# EAGLE design Arduino-UNO-SMD-Rev3e (EAGLE 6.4)
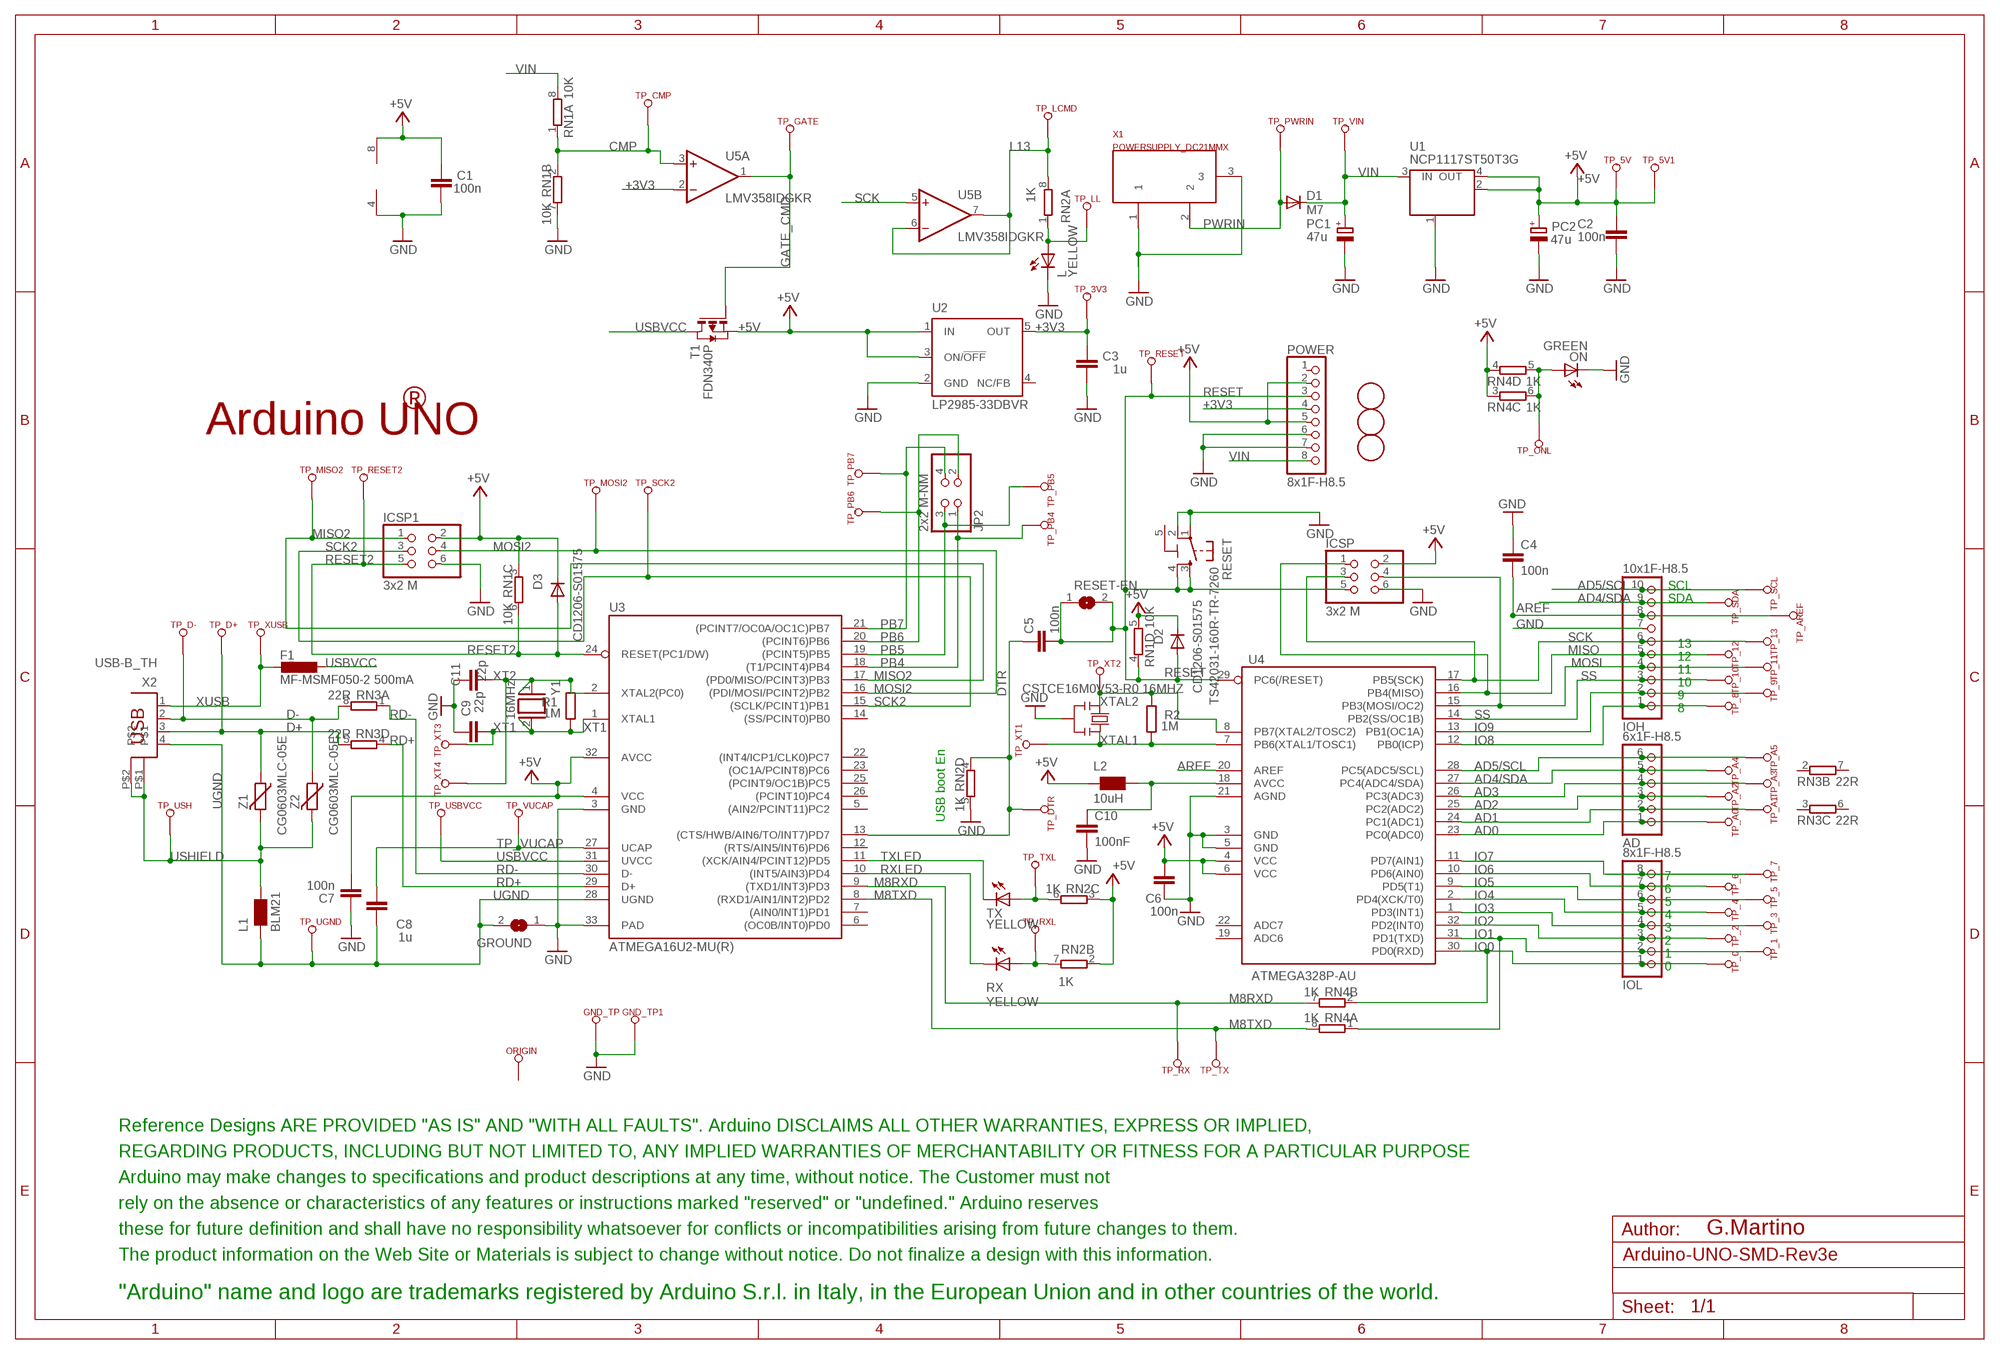
[diagram p0: schematic, sheet 1]

## Parts
AD  6x1F-H8.5  PINHD-1X6  [1X06]
C1  100n  C-EU0603-RND  [C0603-ROUND]
C2  100n  C-EU0603-RND  [C0603-ROUND]
C3  1u  C-EU0603-RND  [C0603-ROUND]
C4  100n  C-EU0603-RND  [C0603-ROUND]
C5  100n  C-EU0603-RND  [C0603-ROUND]
C6  100n  C-EU0603-RND  [C0603-ROUND]
C7  100n  C-EU0603-RND  [C0603-ROUND]
C8  1u  C-EU0603-RND  [C0603-ROUND]
C9  22p  C-EU0603-RND  [C0603-ROUND]
C10  100nF  0015_100NF_0603  [C0603-ROUND]
C11  22p  C-EU0603-RND  [C0603-ROUND]
D1  M7  DIODE-SMB  [SMB]
D2  CD1206-S01575  DIODE-MINIMELF  [MINIMELF]
D3  CD1206-S01575  DIODE-MINIMELF  [MINIMELF]
F1  MF-MSMF050-2 500mA  L-EUL1812  [L1812]
FD1  FIDUCIALMOUNT  [FIDUCIA-MOUNT]
FD2  FIDUCIALMOUNT  [FIDUCIA-MOUNT]
FD3  FIDUCIALMOUNT  [FIDUCIA-MOUNT]
GND_TP  TP_SP  [TP-SP]
GND_TP1  TP_SP  [TP-SP]
GROUND  SJ  [SJ]
ICSP  3x2 M  PINHD-2X3  [2X03]
ICSP1  3x2 M  PINHD-2X3  [2X03]
IOH  10x1F-H8.5  PINHD-1X10_ARD  [1X10]
IOL  8x1F-H8.5  PINHD-1X8  [1X08]
JP2  2x2 M-NM  PINHD-2X2  [2X02]
L  YELLOW  LEDCHIP-LED0805  [CHIP-LED0805]
L1  BLM21  WE-CBF_0805  [0805]
L2  10uH  0715_CV201210-100K  [0805]
ON  GREEN  LEDCHIP-LED0805  [CHIP-LED0805]
ORIGIN  TP_SP  [TP-SP]
PC1  47u  CPOL-EUD  [PANASONIC_D]
PC2  47u  CPOL-EUD  [PANASONIC_D]
POWER  8x1F-H8.5  PINHD-1X8  [1X08]
R1  1M  R-EU_R0603  [R0603-ROUND]
R2  1M  R-EU_R0603  [R0603-ROUND]
RESET  TS42031-160R-TR-7260  TS42  [TS42]
RESET-EN  SJ  [SJ]
RN1  10K  4R-NCAY16  [CAY16]
RN2  1K  4R-NCAY16  [CAY16]
RN3  22R  4R-NCAY16  [CAY16]
RN4  1K  4R-NCAY16  [CAY16]
RX  YELLOW  LEDCHIP-LED0805  [CHIP-LED0805]
T1  FDN340P  PMOSSOT23  [SOT-23]
TP_0  TP_SP  [TP-SP]
TP_1  TP_SP  [TP-SP]
TP_2  TP_SP  [TP-SP]
TP_3  TP_SP  [TP-SP]
TP_3V3  TP_SP  [TP-SP]
TP_4  TP_SP  [TP-SP]
TP_5  TP_SP  [TP-SP]
TP_5V  TP_SP  [TP-SP]
TP_5V1  TP_SP  [TP-SP]
TP_6  TP_SP  [TP-SP]
TP_7  TP_SP  [TP-SP]
TP_8  TP_SP  [TP-SP]
TP_9  TP_SP  [TP-SP]
TP_10  TP_SP  [TP-SP]
TP_11  TP_SP  [TP-SP]
TP_12  TP_SP  [TP-SP]
TP_13  TP_SP  [TP-SP]
TP_A0  TP_SP  [TP-SP]
TP_A1  TP_SP  [TP-SP]
TP_A2  TP_SP  [TP-SP]
TP_A3  TP_SP  [TP-SP]
TP_A4  TP_SP  [TP-SP]
TP_A5  TP_SP  [TP-SP]
TP_AREF  TP_SP  [TP-SP]
TP_CMP  TP_SP  [TP-SP]
TP_D+  TP_SP  [TP-SP]
TP_D-  TP_SP  [TP-SP]
TP_DTR  TP_SP  [TP-SP]
TP_GATE  TP_SP  [TP-SP]
TP_LCMD  TP_SP  [TP-SP]
TP_LL  TP_SP  [TP-SP]
TP_MISO2  TP_SP  [TP-SP]
TP_MOSI2  TP_SP  [TP-SP]
TP_ONL  TP_SP  [TP-SP]
TP_PB4  TP_SP  [TP-SP]
TP_PB5  TP_SP  [TP-SP]
TP_PB6  TP_SP  [TP-SP]
TP_PB7  TP_SP  [TP-SP]
TP_PWRIN  TP_SP  [TP-SP]
TP_RESET  TP_SP  [TP-SP]
TP_RESET2  TP_SP  [TP-SP]
TP_RX  TP_SP  [TP-SP]
TP_RXL  TP_SP  [TP-SP]
TP_SCK2  TP_SP  [TP-SP]
TP_SCL  TP_SP  [TP-SP]
TP_SDA  TP_SP  [TP-SP]
TP_TX  TP_SP  [TP-SP]
TP_TXL  TP_SP  [TP-SP]
TP_UGND  TP_SP  [TP-SP]
TP_USBVCC  TP_SP  [TP-SP]
TP_USH  TP_SP  [TP-SP]
TP_VIN  TP_SP  [TP-SP]
TP_VUCAP  TP_SP  [TP-SP]
TP_XT1  TP_SP  [TP-SP]
TP_XT2  TP_SP  [TP-SP]
TP_XT3  TP_SP  [TP-SP]
TP_XT4  TP_SP  [TP-SP]
TP_XUSB  TP_SP  [TP-SP]
TX  YELLOW  LEDCHIP-LED0805  [CHIP-LED0805]
U1  NCP1117ST50T3G  MC33269ST-3.3T3  [SOT223]
U2  LP2985-33DBVR  LP2985-XXDBVR33  [SOT23-DBV]
U3  ATMEGA16U2-MU(R)  ATMEGA16U2-MU  [MLF32]
U4  ATMEGA328P-AU  ATMEGAXX8-MUR  [MLF32]
U5  LMV358IDGKR  LMV358MMX  [MSOP08]
U$2  DISCLAIMER-SMALL  [DISCLAIMER]
X1  POWERSUPPLY_DC21MMX  [POWERSUPPLY_DC-21MM]
X2  USB-B_TH  PN61729  [PN61729]
Y1  16MHz  XTAL/S  [QS]
Y2  CSTCE16M0V53-R0 16MHZ  RESONATORMU  [RESONATOR]
Z1  CG0603MLC-05E  VARISTORCN0603  [CT/CN0603]
Z2  CG0603MLC-05E  VARISTORCN0603  [CT/CN0603]

## Nets
+3V3: C3.2 POWER.4 TP_3V3.X(TESTP) U2.5(OUT) U5.2(A:-IN)
+5V [usbvcc]: C1.2 C2.2 C6.2 C7.1 D2.C D3.C ICSP1.2 ICSP.2 L2.1 PC2.+ POWER.2 POWER.5 RN1.3 RN1.5 RN2.2 RN2.3 RN4.3 RN4.4 T1.2(S) TP_5V1.X(TESTP) TP_5V.X(TESTP) U1.2(OUT) U1.4(OUT) U2.1(IN) U2.3(ON/!OFF) U3.4(VCC) U3.32(AVCC) U4.4(VCC) U4.6(VCC) U5.8(P:V+)
AD0: AD.1 TP_A0.X(TESTP) U4.23(PC0(ADC0))
AD1: AD.2 TP_A1.X(TESTP) U4.24(PC1(ADC1))
AD2: AD.3 TP_A2.X(TESTP) U4.25(PC2(ADC2))
AD3: AD.4 TP_A3.X(TESTP) U4.26(PC3(ADC3))
AD4/SDA: AD.5 IOH.9 TP_A4.X(TESTP) TP_SDA.X(TESTP) U4.27(PC4(ADC4/SDA))
AD5/SCL: AD.6 IOH.10 TP_A5.X(TESTP) TP_SCL.X(TESTP) U4.28(PC5(ADC5/SCL))
AREF [aref]: C4.2 IOH.8 TP_AREF.X(TESTP) U4.20(AREF)
CMP: RN1.1 RN1.2 TP_CMP.X(TESTP) U5.3(A:+IN)
D+: RN3.5 TP_D+.X(TESTP) X2.3 Z1.1
D-: RN3.8 TP_D-.X(TESTP) X2.2 Z2.1
DTR: C5.1 RN2.4 TP_DTR.X(TESTP) U3.13((CTS/HWB/AIN6/TO/INT7)PD7)
GATE_CMD: T1.3(G) TP_GATE.X(TESTP) U5.1(A:OUT)
GND [gnd]: C1.1 C2.1 C3.1 C4.1 C6.1 C7.2 C9.2 C10.2 C11.2 GND_TP1.X(TESTP) GND_TP.X(TESTP) GROUND.1 ICSP1.6 ICSP.6 IOH.7 L.C ON.C PC1.- PC2.- POWER.6 POWER.7 RESET.1 RESET.2 RN1.7 RN2.5 U1.1(GND/ADJ) U2.2(GND) U3.3(GND) U3.33(PAD) U4.3(GND) U4.5(GND) U4.21(AGND) U5.4(P:V-) X1.1 X1.3 Y2.2
IO0: IOL.1 RN4.2 TP_0.X(TESTP) U4.30(PD0(RXD))
IO1: IOL.2 RN4.1 TP_1.X(TESTP) U4.31(PD1(TXD))
IO2: IOL.3 TP_2.X(TESTP) U4.32(PD2(INT0))
IO3: IOL.4 TP_3.X(TESTP) U4.1(PD3(INT1))
IO4: IOL.5 TP_4.X(TESTP) U4.2(PD4(XCK/T0))
IO5: IOL.6 TP_5.X(TESTP) U4.9(PD5(T1))
IO6: IOL.7 TP_6.X(TESTP) U4.10(PD6(AIN0))
IO7: IOL.8 TP_7.X(TESTP) U4.11(PD7(AIN1))
IO8: IOH.1 TP_8.X(TESTP) U4.12(PB0(ICP))
IO9: IOH.2 TP_9.X(TESTP) U4.13(PB1(OC1A))
L13: RN2.8 TP_LCMD.X(TESTP) U5.6(B:-IN) U5.7(B:OUT)
M8RXD: RN4.7 TP_RX.X(TESTP) U3.9((TXD1/INT3)PD3)
M8TXD: RN4.8 TP_TX.X(TESTP) U3.8((RXD1/AIN1/INT2)PD2)
MISO: ICSP.1 IOH.5 TP_12.X(TESTP) U4.16(PB4(MISO))
MISO2: ICSP1.1 TP_MISO2.X(TESTP) U3.17((PD0/MISO/PCINT3)PB3)
MOSI: ICSP.4 IOH.4 TP_11.X(TESTP) U4.15(PB3(MOSI/OC2))
MOSI2: ICSP1.4 TP_MOSI2.X(TESTP) U3.16((PDI/MOSI/PCINT2)PB2)
N$1: L.A RN2.1 TP_LL.X(TESTP)
N$3: ON.A RN4.5 RN4.6 TP_ONL.X(TESTP)
N$4 [usbvcc]: C10.1 L2.2 U4.18(AVCC)
N$35: RN2.7 RX.A TP_RXL.X(TESTP)
N$36: RN2.6 TP_TXL.X(TESTP) TX.A
PB4: JP2.1 TP_PB4.X(TESTP) U3.18((T1/PCINT4)PB4)
PB5: JP2.3 TP_PB5.X(TESTP) U3.19((PCINT5)PB5)
PB6: JP2.2 TP_PB6.X(TESTP) U3.20((PCINT6)PB6)
PB7: JP2.4 TP_PB7.X(TESTP) U3.21((PCINT7/OC0A/OC1C)PB7)
PWRIN [power]: D1.A TP_PWRIN.X(TESTP) X1.2
RD+: RN3.4 U3.29(D+)
RD-: RN3.1 U3.30(D-)
RESET: C5.2 D2.A ICSP.5 POWER.3 RESET-EN.1 RESET-EN.2 RESET.3 RESET.4 RN1.4 TP_RESET.X(TESTP) U4.29(PC6(/RESET))
RESET2: D3.A ICSP1.5 RN1.6 TP_RESET2.X(TESTP) U3.24(RESET(PC1/DW))
RXLED: RX.C U3.10((INT5/AIN3)PD4)
SCK: ICSP.3 IOH.6 TP_13.X(TESTP) U4.17(PB5(SCK)) U5.5(B:+IN)
SCK2: ICSP1.3 TP_SCK2.X(TESTP) U3.15((SCLK/PCINT1)PB1)
SS: IOH.3 TP_10.X(TESTP) U4.14(PB2(SS/OC1B))
TP_VUCAP: C8.1 TP_VUCAP.X(TESTP) U3.27(UCAP)
TXLED: TX.C U3.11((XCK/AIN4/PCINT12)PD5)
UGND [gnd]: C8.2 GROUND.2 L1.1 TP_UGND.X(TESTP) U3.28(UGND) X2.4
USBVCC [usbvcc]: F1.1 T1.1(D) TP_USBVCC.X(TESTP) U3.31(UVCC)
USHIELD [gnd]: L1.2 TP_USH.X(TESTP) X2.P$1 X2.P$2 Z1.2 Z2.2
VIN [power]: D1.C PC1.+ POWER.8 RN1.8 TP_VIN.X(TESTP) U1.3(IN)
XT1: C9.1 R1.1 TP_XT3.X(TESTP) U3.1(XTAL1) Y1.2
XT2: C11.1 R1.2 TP_XT4.X(TESTP) U3.2(XTAL2(PC0)) Y1.1
XTAL1: R2.1 TP_XT1.X(TESTP) U4.7(PB6(XTAL1/TOSC1)) Y2.3
XTAL2: R2.2 TP_XT2.X(TESTP) U4.8(PB7(XTAL2/TOSC2)) Y2.1
XUSB [usbvcc]: F1.2 TP_XUSB.X(TESTP) X2.1
Unconnected: ORIGIN.X(TESTP) POWER.1 RN3.2 RN3.3 RN3.6 RN3.7 U2.4(NC/FB) U3.5((AIN2/PCINT11)PC2) U3.6((OC0B/INT0)PD0) U3.7((AIN0/INT1)PD1) U3.12((RTS/AIN5/INT6)PD6) U3.14((SS/PCINT0)PB0) U3.22((INT4/ICP1/CLK0)PC7) U3.23((OC1A/PCINT8)PC6) U3.25((PCINT9/OC1B)PC5) U3.26((PCINT10)PC4) U4.19(ADC6) U4.22(ADC7)

## Notes on the sheet
- ®
- Arduino UNO
- SCL
- SDA
- 13
- 12
- 11
- 10
- 9
- 8
- USB boot En
- 7
- 6
- 5
- 4
- 3
- 2
- 1
- 0
- G.Martino

## Power pins joined to a net without a drawn wire
5-GND: RESET.5(5-GND)

## Library data of the parts
AD = SmartPrj:PINHD-1X6: PIN HEADER
C1-C9 C11 = SmartPrj:C-EU: CAPACITOR, European symbol
C10 = Condensatori:0015_100NF_0603: 100nF 0603; CASE: 0603; MONTHLY_USAGE: _____; PART_NUMBER: 100nF_0603; PRICE: _____; SUPPLIER: _____; TYPE: Condensatori
D1-D3 = diode:DIODE-: DIODE
F1 = rcl:L-EU: INDUCTOR, European symbol
FD1-FD3 = SmartPrj:FIDUCIALMOUNT
GND_TP GND_TP1 ORIGIN TP_0 TP_1-TP_3 TP_3V3 TP_4 TP_5 TP_5V TP_5V1 TP_6-TP_13 TP_A0 TP_A1-TP_A5 TP_AREF TP_CMP TP_D+ TP_D- TP_DTR TP_GATE TP_LCMD TP_LL TP_MISO2 TP_MOSI2 TP_ONL TP_PB4-TP_PB7 TP_PWRIN TP_RESET TP_RESET2 TP_RX TP_RXL TP_SCK2 TP_SCL TP_SDA TP_TX TP_TXL TP_UGND TP_USBVCC TP_USH TP_VIN TP_VUCAP TP_XT1-TP_XT4 TP_XUSB = SmartPrj:TP_SP
GROUND RESET-EN = jumper:SJ: SMD solder JUMPER
ICSP ICSP1 = SmartPrj:PINHD-2X3: PIN HEADER
IOH = SmartPrj:PINHD-1X10_ARD: PIN HEADER
IOL POWER = SmartPrj:PINHD-1X8: PIN HEADER
JP2 = SmartPrj:PINHD-2X2: PIN HEADER
L ON RX TX = led:LED: LED OSRAM: - CHIPLED LG R971, LG N971, LY N971, LG Q971, LY Q971, LO R971, LY R971 LH N974, LH R974 LS Q976, LO Q976, LY Q976 LO Q996 - Hyper CHIPLED LW Q18S LB Q993, LB Q99A, LB R99A - SideLED LS A670, LO A670, LY A670, LG A670, LP A670 LB A673, LV A673, LT A673, LW A673 LH A674 LY A675 LS A676, LA A676, LO A676, LY A676, LW A676 LS A679, LY A679, LG A679 - Hyper Micro SIDELED® LS Y876, LA Y876, LO Y876, LY Y876 LT Y87S - SmartLED LW L88C, LW L88S LB L89C, LB L89S, LG L890 LS L89K, LO L89K, LY L89K LS L896, LA L896, LO L896, LY L896 - TOPLED LS T670, LO T670, LY T670, LG T670, LP T670 LSG T670, LSP T670, LSY T670, LOP T670, LYG T670 LG T671, LOG T671, LSG T671 LB T673, LV T673, LT T673, LW T673 LH T674 LS T676, LA T676, LO T676, LY T676, LB T676, LH T676, LSB T676, LW T676 LB T67C, LV T67C, LT T67C, LS T67K, LO T67K, LY T67K, LW E67C LS E67B, LA E67B, LO E67B, LY E67B, LB E67C, LV E67C, LT E67C LW T67C LS T679, LY T679, LG T679 LS T770, LO T770, LY T770, LG T770, LP T770 LB T773, LV T773, LT T773, LW T773 LH T774 LS E675, LA E675, LY E675, LS T675 LS T776, LA T776, LO T776, LY T776, LB T776 LHGB T686 LT T68C, LB T68C - Hyper Mini TOPLED® LB M676 - Mini TOPLED Santana® LG M470 LS M47K, LO M47K, LY M47K Source: http://www.osram.convergy.de LUXEON: - LUMILED® LXK2-PW12-R00, LXK2-PW12-S00, LXK2-PW14-U00, LXK2-PW14-V00 LXK2-PM12-R00, LXK2-PM12-S00, LXK2-PM14-U00 LXK2-PE12-Q00, LXK2-PE12-R00, LXK2-PE12-S00, LXK2-PE14-T00, LXK2-PE14-U00 LXK2-PB12-K00, LXK2-PB12-L00, LXK2-PB12-M00, LXK2-PB14-N00, LXK2-PB14-P00, LXK2-PB14-Q00 LXK2-PR12-L00, LXK2-PR12-M00, LXK2-PR14-Q00, LXK2-PR14-R00 LXK2-PD12-Q00, LXK2-PD12-R00, LXK2-PD12-S00 LXK2-PH12-R00, LXK2-PH12-S00 LXK2-PL12-P00, LXK2-PL12-Q00, LXK2-PL12-R00 Source: www.luxeon.com KINGBRIGHT: KA-3528ASYC Source: www.kingbright.com
L1 = wuerth-elektronik:WE-CBF: SMD EMI Suppression Ferrite Beads - excellent anti-EMI properties - low DCR - impedances till 3000 ohms - rated current up to 6 A
L2 = Induttanze:0715_CV201210-100K: 10uH 0805; CASE: 0805; MONTHLY_USAGE: _____; PART_NUMBER: CV201210-100K; PRICE: _____; SUPPLIER: _____; TYPE: Induttanze
PC1 PC2 = rcl:CPOL-EU: POLARIZED CAPACITOR, European symbol
R1 R2 = SmartPrj:R-EU_: RESISTOR, European symbol
RESET = SmartPrj:TS42: TS42 Dongnan Electronics Tact switch VDC 12V - 50mA
RN1-RN4 = resistor-dil:4R-N: Array Chip Resistor Source: RS Component / Phycomp
T1 = zetex:PMOSSOT23: MOS FET
U1 = linear:MC33269ST*: Adjustable Output Low Dropout Voltage Regulator 800 mA Source: http://www.onsemi.com/pub/Collateral/MC33269-D.PDF
U2 = SmartPrj:LP2985-XXDBVR: ULTRALOW-POWER 50-mA LOW-DROPOUT LINEAR REGULATORS 50-mA Low-Dropout Regulator Source: http://focus.ti.com/lit/ds/symlink/tps77001.pdf
U3 = SmartPrj:ATMEGA16U2-
U4 = SmartPrj:ATMEGAXX8: MICROCONTROLLER 8 Kbytes FLASH 1 kbytes SRAM 512 bytes EEPROM USART 6-channel 10 bit ADC 2-channel 8 bit ADC Source: avr.lbr
U5 = linear:LMV358?*: Dual General Purpose, Low Voltage, Rail-to-Rail Output Operational Amplifiers Source: http://www.national.com/mpf/LM/LMV321.html http://www.national.com/dt/lmv_qual.pdf
U$2 = Misc:DISCLAIMER-SMALL: DISCLAIMER
X1 = SmartPrj:POWERSUPPLY_DC21MM
X2 = SmartPrj:PN61729: BERG USB connector
Y1 = SmartPrj:XTAL/S: CRYSTAL
Y2 = SmartPrj:RESONATOR
Z1 Z2 = varistor:VARISTOR: VARISTOR

## Net classes
0 default: width 0.254 mm, clearance 0.254 mm
1 power: width 0.61 mm, drill 0.61 mm, clearance 0.254 mm
2 gnd: width 0.305 mm, drill 0.559 mm, clearance 0.254 mm
3 usbvcc: width 0.508 mm, drill 0.61 mm, clearance 0.254 mm
4 aref: width 0.406 mm, drill 0.61 mm, clearance 0.254 mm

## Board
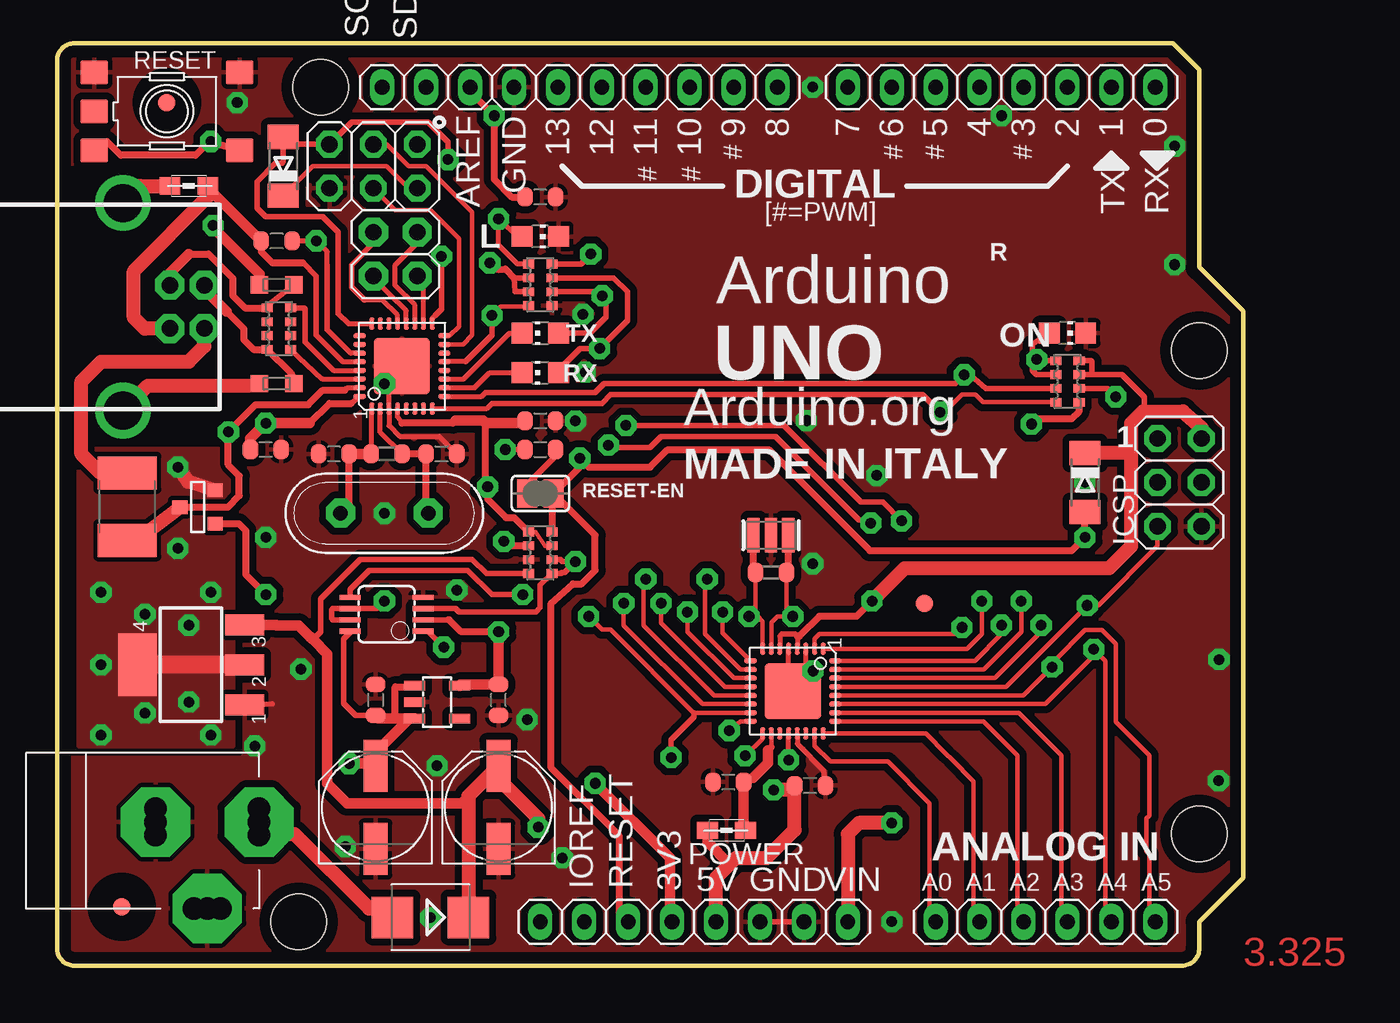
[diagram p1: board, top side]
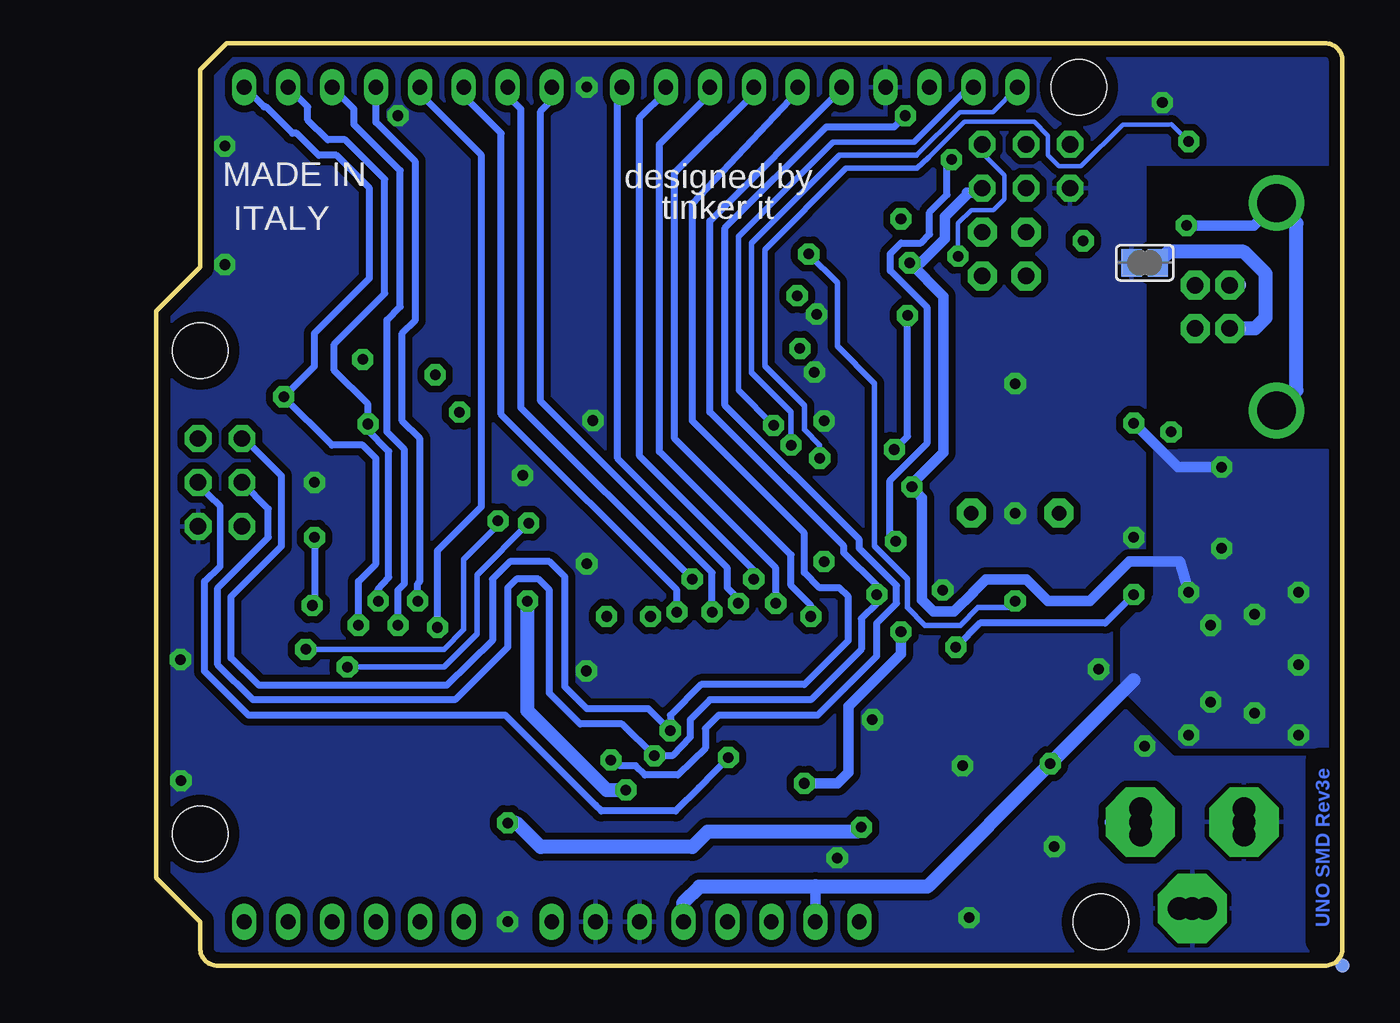
[diagram p2: board, bottom side, seen from below]

Size 68.58 x 53.34 mm. Coordinates in mm from the lower left corner, seen from the top.
Outline: 0,1 arc90 1,0 65.04,0 arc90 66.04,1 66.04,2.54 68.58,5.08 68.58,37.85 66.04,40.39 66.04,51.82 64.52,53.34 1,53.34 arc90 0,52.34
Outline: 0,52.32 0,1.02
Copper layers (1*16): Top 0.035mm / dielectric 1.5mm / Bottom 0.035mm
Design rules "ArduinoUno *": minimum track width 10mil, minimum drill 22mil, track to track 10mil, track to pad 10mil, pad to pad 10mil, via to via 12mil, smd to smd 8mil, copper to edge 26mil, drill to drill 12mil, minimum pad ring 10mil, minimum via ring 12mil, stop-mask expansion 1mil, vias tented up to drill 30mil, thermal gap 10mil
Holes 3.2 mm at 66.04,35.56 66.04,7.62 15.24,50.8 13.97,2.54
bKeepout: area -0.1,3.2 to 1.9,11
bRestrict: 5 lines
vRestrict: area 22.9,44.1 to 24.6,49.1; area 25.4,45.5 to 27.1,49.1; area 28.4,45.3 to 29.6,48.8; area 31,45.3 to 32.1,48.8; area 33.5,45.3 to 34.7,48.8; area 36.1,45.3 to 37.2,48.8; area 38.7,47.2 to 39.9,48.8; area 40.3,45.1 to 47.6,46.9; area 60.3,44.2 to 61.7,46.7; area 62.9,44.2 to 64.3,46.7; area 61.3,35.8 to 64.8,37.2; area 0.6,21.8 to 2,30.1; area 5.7,22.6 to 7.4,30.1; area 47.9,10.3 to 48.5,10.8; area 50.4,10.2 to 50.9,11; area 11.3,28.8 to 12.7,31.1; area 44.8,47.5 to 46.1,48.9; area 47.6,47.4 to 48.8,48.9; area 50.2,47.4 to 51.3,48.9; area 52.8,47.4 to 54,48.9; area 55.2,47.4 to 56.4,48.9; area 57.9,47.4 to 59.1,48.9; area 60.5,47.4 to 61.6,48.9; area 63,47.4 to 64.1,48.9; area 41.3,47.2 to 42.4,48.8; area 0.3,12.4 to 9.4,24.5

### Footprints (pad centres in the part's own frame; a part is rotated, then mirrored left to right if it is on the bottom)
1X06 = drill 0.85 pad 1.422 long: 1 -6.35,0; 2 -3.81,0; 3 -1.27,0; 4 1.27,0; 5 3.81,0; 6 6.35,0
C0603-ROUND = smd 0.898 x 1.1: 1 -0.889,0; 2 0.889,0
SMB = smd 2.4 x 2.4: A 2.2,0; C -2.2,0
MINIMELF = smd 1.4 x 1.8: A 1.7,0; C -1.7,0
L1812 = smd 1.9 x 3.4: 1 -1.95,0; 2 1.95,0
FIDUCIA-MOUNT = smd 1.016 x 1.016: P$1 0,0
TP-SP = smd 0.8 x 0.8 bottom: X 0,0
SJ = smd 1.168 x 1.6: 1 -0.762,0; 2 0.762,0
2X03 = drill 0.95 pad 1.55 octagon: 1 -2.54,-1.27; 2 -2.54,1.27; 3 0,-1.27; 4 0,1.27; 5 2.54,-1.27; 6 2.54,1.27
1X10@1 = drill 0.85 pad 1.422 long: 1 -11.43,0; 2 -8.89,0; 3 -6.35,0; 4 -3.81,0; 5 -1.27,0; 6 1.27,0; 7 3.81,0; 8 6.35,0; 9 8.89,0; 10 11.43,0
1X08 = drill 0.85 pad 1.422 long: 1 -8.89,0; 2 -6.35,0; 3 -3.81,0; 4 -1.27,0; 5 1.27,0; 6 3.81,0; 7 6.35,0; 8 8.89,0
2X02 = drill 0.95 pad 1.676 octagon: 1 -1.27,-1.27; 2 -1.27,1.27; 3 1.27,-1.27; 4 1.27,1.27
CHIP-LED0805 = smd 1.2 x 1.2: A 0,-1.05; C 0,1.05
0805 = smd 1.2 x 1: 1 -1.1,0; 2 1.1,0
PANASONIC_D = smd 3 x 1.4: + 2.4,0; - -2.4,0
R0603-ROUND = smd 0.898 x 1.1: 1 -0.889,0; 2 0.889,0
TS42 = smd 1.6 x 1.4: 1 -4.2,2.25; 2 4.2,2.25; 3 -4.2,-2.25; 4 4.2,-2.25; 5 -4.2,0
CAY16 = smd 0.5 x 0.65: 1 -1.2,-0.675; 2 -0.4,-0.675; 3 0.4,-0.675; 4 1.2,-0.675; 5 1.2,0.675; 6 0.4,0.675; 7 -0.4,0.675; 8 -1.2,0.675
SOT-23 = smd 0.787 x 0.889: 1 0.025,-1.016; 2 -0.94,1.016; 3 0.991,1.016
SOT223 = smd 1.219 x 2.235: 1 -2.311,-3.099; 2 0,-3.099; 3 2.311,-3.099 | smd 3.6 x 2.2: 4 0,3.099
SOT23-DBV = smd 0.55 x 1.2: 1 -0.95,-1.3; 2 0,-1.3; 3 0.95,-1.3; 4 0.95,1.3; 5 -0.95,1.3
MLF32 = smd 0.7 x 0.28: 1 -2.45,1.75; 2 -2.45,1.25; 3 -2.45,0.75; 4 -2.45,0.25; 5 -2.45,-0.25; 6 -2.45,-0.75; 7 -2.45,-1.25; 8 -2.45,-1.75; 17 2.45,-1.75; 18 2.45,-1.25; 19 2.45,-0.75; 20 2.45,-0.25; 21 2.45,0.25; 22 2.45,0.75; 23 2.45,1.25; 24 2.45,1.75 | smd 0.28 x 0.7: 9 -1.75,-2.45; 10 -1.25,-2.45; 11 -0.75,-2.45; 12 -0.25,-2.45; 13 0.25,-2.45; 14 0.75,-2.45; 15 1.25,-2.45; 16 1.75,-2.45; 25 1.75,2.45; 26 1.25,2.45; 27 0.75,2.45; 28 0.25,2.45; 29 -0.25,2.45; 30 -0.75,2.45; 31 -1.25,2.45; 32 -1.75,2.45 | smd 3.254 x 3.254: 33 0,0
MSOP08 = smd 0.3 x 1.2: 1 -0.976,-2.113; 2 -0.326,-2.113; 3 0.324,-2.113; 4 0.974,-2.113; 5 0.974,2.112; 6 0.324,2.112; 7 -0.326,2.112; 8 -0.976,2.112
POWERSUPPLY_DC-21MM = drill 1.3 pad 4 octagon: 1 -5.08,-3.353; 2 -0.076,-6.35; 3 -0.076,-0.356 | drill 1.3: 4 -5.08,-4.115; 5 -5.08,-2.591; 6 -0.838,-0.356; 7 0.686,-0.356; 8 -0.838,-6.35; 9 0.686,-6.35
PN61729 = drill 0.95 pad 1.676 octagon: 1 1.25,4.71; 2 -1.25,4.71; 3 -1.25,2.71; 4 1.25,2.71 | drill 2.2: P$1 -6,0; P$2 6,0
QS = drill 0.85 pad 1.676 octagon: 1 -2.54,0; 2 2.54,0
RESONATOR = smd 0.7 x 2: 1 -1,0; 2 0,0; 3 1,0
CT/CN0603 = smd 1 x 1: 1 -1,0; 2 1,0

### Placement (x,y rotation side)
AD  57.15,2.54 0 top
C1  18.41,15.37 270 top
C2  12.06,29.84 180 top
C3  25.53,15.37 90 top
C4  27.94,44.45 180 top
C5  27.94,29.84 0 top
C6  43.54,10.41 180 top
C7  27.94,31.5 0 top
C8  12.7,41.91 180 top
C9  16,29.59 180 top
C10  38.81,10.62 180 top
C11  22.23,29.59 0 top
D1  21.59,2.79 180 top
D2  59.44,27.94 270 top
D3  13.08,46.23 90 top
F1  4.06,26.54 90 top
FD1  6.35,49.91 0 top
FD2  50.16,20.93 0 top
FD3  3.73,3.41 0 top
GND_TP  43.18,2.54 0 top
GND_TP1  26.42,50.8 0 top
GROUND  11.43,40.64 0 bottom
ICSP  64.9,27.94 270 top
ICSP1  18.29,46.23 180 top
IOH  10x1F-H8.5  [1X10@1]  30.23,50.8 180 top
IOL  54.61,50.8 180 top
JP2  19.56,41.15 90 top
L  27.94,42.16 270 top
L1  7.62,45.09 180 top
L2  38.71,7.82 0 top
ON  58.42,36.58 270 top
ORIGIN  0,0 0 top
PC1  25.53,9.14 90 top
PC2  18.41,9.14 90 top
POWER  36.83,2.54 0 top
R1  19.05,29.59 0 top
R2  41.27,22.73 180 top
RESET  6.35,49.4 0 top
RESET-EN  27.94,27.3 0 top
RN1  27.94,23.88 90 top
RN2  27.94,39.37 270 top
RN3  12.83,36.83 90 top
RN4  58.42,33.78 90 top
RX  27.94,34.29 90 top
T1  8.13,26.54 270 top
TP_0  63.5,50.8 0 top
TP_1  60.96,50.8 0 top
TP_2  58.42,50.8 0 top
TP_3  55.88,50.8 0 top
TP_3V3  35.56,2.54 0 top
TP_4  53.34,50.8 0 top
TP_5  50.8,50.8 0 top
TP_5V  38.1,2.54 0 top
TP_5V1  66.17,30.48 0 top
TP_6  48.26,50.8 0 top
TP_7  45.72,50.8 0 top
TP_8  41.66,50.8 0 top
TP_9  39.12,50.8 0 top
TP_10  36.58,50.8 0 top
TP_11  34.04,50.8 0 top
TP_12  31.5,50.8 0 top
TP_13  28.96,50.8 0 top
TP_A0  50.8,2.54 0 top
TP_A1  53.34,2.54 0 top
TP_A2  55.88,2.54 0 top
TP_A3  58.42,2.54 0 top
TP_A4  60.96,2.54 0 top
TP_A5  63.5,2.54 0 top
TP_AREF  23.88,50.8 0 top
TP_CMP  29.97,23.37 0 top
TP_D+  5.97,39.37 0 top
TP_D-  8.51,39.37 0 top
TP_DTR  25.91,29.84 0 top
TP_GATE  12.06,21.46 0 top
TP_LCMD  18.92,21.08 0 top
TP_LL  25.53,43.18 0 top
TP_MISO2  20.83,47.5 0 top
TP_MOSI2  18.29,44.96 0 top
TP_ONL  56.64,35.05 0 top
TP_PB4  20.83,39.88 0 top
TP_PB5  20.83,42.42 0 top
TP_PB6  18.29,39.88 0 top
TP_PB7  18.29,42.42 0 top
TP_PWRIN  13.21,8.26 0 top
TP_RESET  33.02,2.54 0 top
TP_RESET2  15.75,47.5 0 top
TP_RX  52.45,34.16 0 top
TP_RXL  31.37,35.69 0 top
TP_SCK2  18.29,47.5 0 top
TP_SCL  18.8,50.8 0 top
TP_SDA  21.34,50.8 0 top
TP_TX  51.05,32 0 top
TP_TXL  31.37,38.73 0 top
TP_UGND  5.97,36.83 0 top
TP_USBVCC  9.91,30.86 0 top
TP_USH  9.02,42.8 0 top
TP_VIN  45.72,2.54 0 top
TP_VUCAP  14.99,41.91 0 top
TP_XT1  42.55,20.19 0 top
TP_XT2  40.01,20.19 0 top
TP_XT3  16.38,26.16 0 top
TP_XT4  21.46,26.16 0 top
TP_XUSB  8.51,36.83 0 top
TX  27.94,36.58 90 top
U1  7.75,17.4 90 top
U2  21.97,15.24 270 top
U3  19.94,34.67 90 top
U4  42.55,15.88 270 top
U5  19.05,20.32 90 top
U$2  -13.72,-23.27 0 top  (outside the outline)
X1  5.33,8.38 90 top
X2  3.81,38.1 270 top
Y1  18.92,26.16 180 top
Y2  41.27,24.89 0 top
Z1  12.7,39.37 180 top
Z2  12.7,33.66 180 top

### Tracks (layer width: path | path; a pad name or v marks a point on that pad's centre or on a via)
+3V3  (via drill 0.61)
  Top 0.305: 22.61,19.99 U5.2
  Top 0.406: 22.61,19.99 22.68,19.99 23.37,19.3 v25.53,19.3
  Top 0.61: v31.11,10.54 35.43,6.22 35.43,2.67 TP_3V3.X | U2.5 23.34,16.26 C3.2 v25.53,19.3
  Bottom 0.61: v31.11,10.54 29.21,10.54 28.57,11.18 28.57,14.99 25.53,18.03 v25.53,19.3
+5V  (via drill 0.61)
  Top 0.254: 27.32,25.02 RN1.5 27.65,25.08 28.23,24.28 RN1.3 | ICSP1.2 20.32,44.96 19.05,46.23 14.78,46.23 D3.C
  Top 0.279: U3.4 19.69,31.75 19.94,31.37 | U3.32 17.43,32.92 17.02,32.51 | 41.91,19.18 41.8,19.06 U4.6 | 42.8,19.05 U4.4
  Top 0.305: 59.82,34.18 61.58,34.18 62.87,32.89 62.87,32.05 | 59.82,34.18 RN4.3 | RN4.4 59.76,34.98 59.82,34.92 59.82,34.18 | RN2.2 26.43,39.77 26.47,38.97 RN2.3 | U5.8 16.98,19.3 16.57,18.9 16.57,15.18 17.27,14.48 C1.2 | 42.8,19.05 42.67,19.18 41.91,19.18
  Top 0.406: 26.43,39.77 25.93,40.28 25.53,40.26 v25.02,40.64 | RN1.5 26.43,25.91 25.96,25.91 24.89,26.97 v24.89,27.69 24.77,28.19 24.77,31.38 | 19.94,31.37 22.89,31.37 23.03,31.51 | 17.02,32.51 15.75,32.51 14.61,31.37 | U2.1 20.61,16.13 19.56,16.13 19.56,14.29 | 42.8,19.05 42.93,19.05 44.07,20.19 46.23,20.19 v47.12,21.08
  Top 0.508: 11.02,17.42 U1.2 | TP_5V1.X 66.04,30.48
  Top 0.61: 23.03,31.51 24.64,31.51 24.77,31.38 26.94,31.38 C7.1 | 11.05,29.72 C2.2 11.18,30.48 v12.06,31.37 14.61,31.37 | v16.89,11.68 18.78,11.68 PC2.+ 18.41,12.32 20.39,14.29 U2.3 19.56,14.29 18.6,14.29 C1.2 | L2.1 37.61,7.14 38.89,5.87
  Top 0.813: 66.17,30.44 TP_5V1.X 66.17,31.11 65.1,32.05 62.87,32.05 62.79,32.05 62.1,31.37 62.1,29.46 | 62.1,29.46 62.1,24.26 60.83,22.99 49.02,22.99 v47.12,21.08 | T1.2 7.57,27.99 v6.99,28.83 | D2.C 61.93,29.64 62.1,29.46 | TP_5V.X 38.1,5.08 38.89,5.87 39.24,6.22 41.02,6.22 42.65,7.85 C6.2 42.39,10.16 v41.43,10.16
  Top 1.016: U1.4 5.84,17.4 5.87,17.42 11.02,17.42
  Bottom 0.61: ICSP1.2 21.08,44.7 21.72,44.7 21.72,44.58 22.99,43.31 22.99,42.04 24.38,40.64 v25.02,40.64 23.07,38.69 23.07,29.68 24.89,27.85 v24.89,27.69 24.31,27.05 24.31,21.13 23.65,20.47 22.45,20.47 21.34,21.59 21.36,21.59 20.62,22.33 18.26,22.33 17.02,21.08 14.61,21.08 12.32,23.37 9.4,23.37 v8.89,21.59 | POWER.2 30.48,4.7 30.61,4.57 | v12.06,31.37 9.53,28.83 v6.99,28.83
  Bottom 0.813: TP_5V.X 38.12,3.63 37.19,4.57 30.61,4.57 24,4.57 v16.89,11.68 12.06,16.51 | v47.12,21.08 47.12,14.73 42.55,10.16 v41.43,10.16
  other vias: 2.54,21.59 5.08,20.32 6.99,24.13 2.54,13.34 5.08,14.61 2.54,17.4 8.89,13.34 7.62,15.24 7.62,19.68
  pour Bottom (isolate 0.406, no thermals): 0.89,29.72 10.79,29.72 10.79,21.34 12.7,19.43 12.7,16.13 9.27,12.7 0.89,12.7
  pour Top (no thermals): 1.27,12.7 1.27,29.84 10.16,29.84 10.16,12.7
AD0
  Top 0.254: TP_A0.X 50.44,3 50.44,9.4 48.03,11.81 44.7,11.81 43.8,12.72 U4.23
AD1
  Top 0.254: TP_A1.X 52.98,3 52.98,10.67 51.7,11.95 51.44,12.22 50.23,13.43 U4.24
AD2
  Top 0.254: TP_A2.X 55.52,3 55.52,12.17 53.57,14.12 U4.25
AD3
  Top 0.254: TP_A3.X 58.06,3 58.06,12.17 55.61,14.62 U4.26
AD4/SDA  (via drill 0.61)
  Top 0.254: TP_A4.X 60.6,3 60.6,17.63 v59.94,18.29 59.94,17.93 57.14,15.12 U4.27
  Top 0.305: v32.89,31.24 42.04,31.24 46.48,26.8 47.75,26.8 v48.83,25.72 49.02,25.65
  Bottom 0.305: TP_SDA.X 21.59,50.8 24.77,47.62 29.46,47.62 34.92,42.16 34.92,33.27 v32.89,31.24 | v48.83,25.72 48.9,25.65 48.9,25.4 50.8,23.5 50.8,19.43 51.94,18.29 v59.94,18.29
AD5/SCL  (via drill 0.61)
  Top 0.254: TP_A5.X 63.14,3 63.14,6.45 62.99,6.6 62.99,8.51 63.14,8.66 63.14,12.17 61.21,14.1 61.21,18.59 60.4,19.41 59.44,19.41 57.71,17.68 57.71,17.45 v57.53,17.27 55.88,15.62 U4.28
  Top 0.305: v31.88,30.1 31.88,29.97 34.29,29.97 34.92,30.61 41.53,30.61 46.35,25.78 46.86,25.78 v47.05,25.59
  Bottom 0.254: TP_SCL.X 20.22,49.35 22.12,49.35 24.64,46.86
  Bottom 0.305: v31.88,30.1 31.88,32 34.16,34.29 34.16,41.78 29.08,46.86 24.64,46.86 | v47.05,25.59 50.04,22.61 50.04,19.18 51.94,17.27 v57.53,17.27
AREF  (via drill 0.61)
  Top 0.279: 42.3,12.07 U4.20
  Top 0.305: v42.29,11.89 42.3,12.07
  Top 0.406: TP_AREF.X 23.88,50.55 v25.27,49.15 25.27,45.47 26.29,44.45 C4.2
  Bottom 0.406: v25.27,49.15 25.91,48.51 29.84,48.51 35.69,42.67 35.69,32.38 27.94,24.64 27.94,24.13 25.78,21.97 25.78,20.95 26.92,19.81 26.92,17.91 30.35,14.48 36.07,14.48 36.83,13.72 36.83,12.57 38.43,11.02 40.34,11.02 40.87,11.56 41.78,11.56 v42.29,11.89
CMP  (via drill 0.61)
  Top 0.305: U5.3 23.04,20.64 23.24,20.45 27.69,20.45 27.94,20.7 27.94,22 RN1.1 29.15,22.68 29.21,22.73 29.34,22.73 TP_CMP.X 29.21,23.37 29.1,23.48 RN1.2
  other vias: 29.97,23.37
D+
  Top 0.305: Z1.1 12.1,38.1 RN3.5
  Top 0.406: 7.62,41.15 8.76,41.15 10.16,39.75 10.16,38.73 10.87,38.03 RN3.5
  Top 0.61: X2.3 6.52,40.05 7.62,41.15
  Bottom 0.61: TP_D+.X 6.5,39.37 X2.3
D-
  Top 0.406: 9.82,37.81 10.79,36.83 10.79,36.2 11.36,35.63 RN3.8 13.49,34.29 Z2.1
  Top 0.61: X2.2 8.53,39.1 9.82,37.81
  Bottom 0.305: TP_D-.X X2.2
DTR  (via drill 0.61)
  Top 0.254: v25.15,37.59 25.65,38.1 27.2,38.1
  Top 0.279: 23.62,34.92 U3.13
  Top 0.305: TP_DTR.X C5.1 | 27.2,38.1 RN2.4 | 23.62,34.92 25.15,36.45 v25.15,37.59
  Bottom 0.406: TP_DTR.X 25.15,30.61 v25.15,37.59
  other vias: 25.91,29.84
GATE_CMD  (via drill 0.61)
  Top 0.305: U5.1 21.42,19.34 v22.35,18.41
  Top 0.406: T1.3 10.52,25.55 10.92,25.15 10.92,22.61 TP_GATE.X
  Bottom 0.406: v22.35,18.41 20.95,19.81 13.72,19.81 TP_GATE.X
  other vias: 12.06,21.46
GND  (via drill 0.61)
  Top 0.279: C11.2 22.1,30.61 19.81,30.61 19.19,31.23 U3.3 19.19,33.39 v18.92,33.66 | 43.3,17.46 U4.3 | 42.3,17.27 U4.5 | U4.21 42.8,12.83 44.32,11.3
  Top 0.305: POWER.6 GND_TP.X | U1.1 12.45,15.14 | 19.19,33.52 v18.92,33.66 U3.33 | 43.3,17.46 v43.71,17.04 43.69,17.02 42.55,17.02 42.3,17.27 | 44.32,11.3 C6.1
  Bottom 0.305: GROUND.1 10.79,40.64
  other vias: 29.21,6.22 27.18,14.22 16.66,6.88 30.53,34.32 54.61,49.15 30.4,37.67 11.43,12.7 43.69,23.24 29.97,31.5 43.69,50.8 48.26,2.54 59.44,27.94 21.59,2.77 67.16,10.69 64.62,47.4 12.06,24.77 67.18,17.7 23.11,21.72 10.41,49.91 47.4,28.35 18.92,26.16 43.33,31.52 21.97,11.56 14.1,17.14 64.62,40.54
  pour Bottom (isolate 0.406, rank 2): 0.64,52.7 67.69,52.7 67.94,52.45 67.94,0.64 0.89,0.64 0.64,0.89 0.64,30.1 11.43,30.1 11.43,46.35 0.64,46.35
  pour Top (isolate 0.406, rank 2): 0.64,52.7 67.94,52.7 67.94,0.64 0.64,0.64 0.51,30.48 11.43,30.48 11.43,46.35 0.64,46.35
IO0  (via drill 0.61)
  Top 0.254: U4.30 54.22,16.62 56.9,19.3 v56.9,19.68
  Top 0.305: RN4.2 60.73,33.38 v61.21,32.89
  Bottom 0.406: TP_0.X 62.36,49.66 62.23,49.66 60.71,48.13 60.45,48.13 59.18,46.86 58.17,46.86 56.26,44.96 56.26,39.75 59.44,36.58 59.44,34.67 v61.21,32.89 58.42,30.1 56.64,30.1 55.88,29.34 55.88,23.24 56.9,22.23 v56.9,19.68
IO1  (via drill 0.61)
  Top 0.254: U4.31 53.57,17.12 55.75,19.3 v55.75,21.08
  Top 0.406: RN4.1 59.09,32.04 58.67,31.62 56.64,31.62 v56.34,31.32
  Bottom 0.406: TP_1.X 59.82,49.66 59.82,48.9 58.67,47.75 57.66,47.75 55.37,45.47 55.37,38.86 58.29,35.94 58.29,34.42 56.34,32.46 v56.34,31.32 56.39,31.11 56.39,30.99 55.14,29.74 55.14,22.45 55.75,21.79 v55.75,21.08
IO2  (via drill 0.61)
  Top 0.254: U4.32 53.06,17.62 54.61,19.18 v54.61,19.68
  Bottom 0.406: TP_2.X 57.15,49.53 57.15,48.64 54.48,45.97 54.48,38.1 55.24,37.34 55.24,30.86 54.23,29.84 54.23,22.1 54.61,21.72 v54.61,19.68
IO3  (via drill 0.61)
  Top 0.254: U4.1 52.62,18.32 53.47,19.18 v53.47,21.08
  Bottom 0.406: TP_3.X 55.88,48.77 53.59,46.48 53.59,37.34 54.36,36.58 54.36,31.5 53.34,30.48 53.34,22.23 53.47,22.1 v53.47,21.08
IO4  (via drill 0.61)
  Top 0.254: U4.2 43.8,18.9 44.07,19.18 51.94,19.18 v52.32,19.56
  Bottom 0.406: TP_4.X 53.21,50.29 49.78,46.86 49.78,26.54 52.32,24 v52.32,19.56
IO5  (via drill 0.61)
  Top 0.254: U4.9 38.48,19.24 v38.48,20.45
  Bottom 0.406: TP_5.X 50.8,50.29 48.64,48.13 48.64,31.88 38.48,21.72 v38.48,20.45
IO6  (via drill 0.61)
  Top 0.254: U4.10 39.52,17.12 37.47,19.18 37.47,22.23 v37.59,22.35
  Bottom 0.406: TP_6.X 48.26,50.29 47.5,49.53 47.5,32.26 v37.59,22.35
IO7  (via drill 0.61)
  Top 0.254: U4.11 39.13,16.62 36.45,19.3 v36.45,20.45
  Bottom 0.406: TP_7.X 45.72,50.04 46.35,49.4 46.35,32.64 36.45,22.73 v36.45,20.45
IO8  (via drill 0.61)
  Top 0.254: U4.12 38.61,16.12 34.92,19.81 v34.92,20.95
  Bottom 0.406: TP_8.X 41.66,50.29 41.91,50.55 41.91,29.34 35.56,22.99 35.56,21.84 34.92,21.21 v34.92,20.95
IO9  (via drill 0.61)
  Top 0.254: U4.13 37.97,15.62 33.91,19.68 33.91,22.1 34.04,22.23 v34.04,22.35
  Bottom 0.406: TP_9.X 39.12,50.55 40.64,49.02 40.64,29.46 34.04,22.86 v34.04,22.35
L13  (via drill 0.61)
  Top 0.305: U5.7 15.95,19.99 15.88,20.07 15.88,20.57 15.95,20.64 U5.6 18.48,20.64 TP_LCMD.X | RN2.8 30.28,40.57 v30.86,41.15
  Bottom 0.305: v30.86,41.15 29.21,39.5 29.21,35.81 27.05,33.66 27.05,24.26 25.15,22.35 25.15,20.7 24.13,19.68 22.1,19.68 21.08,20.7 19.3,20.7 TP_LCMD.X
  other vias: 18.92,21.08
M8RXD  (via drill 0.61)
  Top 0.279: U3.9 24.54,32.92 24.77,33.15
  Top 0.305: RN4.7 53.7,33.38 52.79,34.16 TP_RX.X 51.94,33.66 31.62,33.66 31.11,33.15 24.77,33.15
  other vias: 52.45,34.16
M8TXD  (via drill 0.61)
  Top 0.254: RN4.8 53.52,32.58 53.09,33.02 52.32,33.02 51.31,32 TP_TX.X
  Top 0.279: U3.8 24.86,32.22 25.15,32.51
  Top 0.305: 25.15,32.51 31.5,32.51 32,33.02 50.04,33.02 TP_TX.X
  other vias: 51.05,32
MISO  (via drill 0.61)
  Top 0.254: U4.16 39.52,14.12 v38.86,13.59
  Bottom 0.406: TP_12.X 31.5,50.55 37.59,44.07 37.59,31.5 31.11,25.02 31.11,22.73 30.23,21.84 29.08,21.84 28.57,21.34 28.57,18.8 31.11,16.26 37.08,16.26 38.86,14.48 v38.86,13.59 40.13,14.86 43.69,14.86 44.96,16.13 44.96,22.48 45.85,23.37 48.13,23.37 49.15,22.35 49.15,18.8 51.79,16.2 62.64,16.2 64.26,17.78 64.26,21.34 61.34,24.26 61.34,28.32 63.45,30.43 ICSP.1
MISO2  (via drill 0.61)
  Top 0.254: v22.23,41.02 22.23,39.5
  Top 0.279: 21.84,37.59 21.69,37.44 U3.17
  Top 0.305: v22.23,41.02 22.23,37.97 21.84,37.59
  Bottom 0.254: v22.23,41.02 22.23,42.93 21.46,43.69 20.19,43.69 19.56,44.32 19.56,45.72 20.83,46.99 TP_MISO2.X
MOSI  (via drill 0.61)
  Top 0.254: 36.81,14.62 U4.15 | 36.81,14.62 32,19.43 31.5,19.43 v30.73,20.19 | 36.83,14.61 36.81,14.62
  Top 0.305: 36.83,14.61 36.83,14.38 35.51,13.06 v35.51,12.04
  Bottom 0.381: 64.9,23.09 64.9,26.57
  Bottom 0.406: TP_11.X 34.04,50.42 38.61,45.85 38.61,30.48 31.88,23.75 31.88,21.97 30.73,20.83 v30.73,20.19 | ICSP.4 66.18,27.83 64.9,26.57 | 64.9,23.09 65.79,22.23 65.79,17.02 63.25,14.48 48.39,14.48 43.32,9.41 43.18,9.27 42.85,8.94 38.56,8.94 37.21,10.29 v35.51,12.04
MOSI2
  Top 0.254: TP_MOSI2.X 19.56,43.69 21.59,43.69 23.24,42.04 23.24,36.96 22.7,36.42 U3.16
N$1  (via drill 0.61)
  Top 0.279: RN2.1 26.61,40.57 25.53,41.66 TP_LL.X 26.67,42.16 L.A
  other vias: 25.53,43.18
N$3  (via drill 0.61)
  Top 0.305: RN4.6 56.62,34.18 56.39,34.42 56.39,35.31 | 56.39,35.31 56.39,35.94 ON.A | RN4.5 56.97,34.98 TP_ONL.X 56.39,35.31
  other vias: 56.64,35.05
N$4
  Top 0.254: U4.18 41.3,12.64
  Top 0.406: 41.3,12.64 41.1,12.45 | 40.23,10.87 39.95,10.87 C10.1
  Top 0.61: 41.1,12.45 41.1,11.73 40.23,10.87 | C10.1 39.7,7.93 L2.2
N$35  (via drill 0.61)
  Top 0.305: RX.A 28.96,34.29 28.96,34.42 30.23,35.69 TP_RXL.X 32.97,37.29 32.97,38.96 32.16,39.77 RN2.7
  other vias: 31.37,35.69
N$36  (via drill 0.61)
  Top 0.305: TX.A 29.25,36.57 30.8,36.57 31.75,37.52 31.75,38.35 v31.52,38.73 31.13,38.97 RN2.6
  Bottom 0.406: TP_TXL.X v31.52,38.73
PB4
  Top 0.279: U3.18 21.19,39.52
  Top 0.305: 21.19,39.52 TP_PB4.X
PB5
  Top 0.279: 20.83,41.78 19.56,40.51 19.56,39.32 20.69,38.19 U3.19
  Top 0.305: 20.83,41.78 TP_PB5.X
PB6
  Top 0.279: U3.20 20.19,37.88 18.29,39.73 TP_PB6.X
PB7
  Top 0.279: 17.78,38.48 18.8,38.48 19.69,37.61 U3.21
  Top 0.305: TP_PB7.X 18.29,41.78 17.02,40.51 17.02,39.24 17.78,38.48
PWRIN
  Top 0.813: D1.A 18.88,3.3 18.03,3.3 13.72,7.62 12.37,7.62 X1.2
  Bottom 0.813: 13.34,8.31 13.28,8.26 TP_PWRIN.X 11.73,8.26 X1.2
RD+
  Top 0.279: U3.29 16,34.42 14.35,36.07
  Top 0.305: 14.35,36.07 14.35,37.97 14.29,38.03 RN3.4
RD-
  Top 0.254: RN3.1 13.53,35.63
  Top 0.279: U3.30 15.34,33.92 RN3.1
RESET  (via drill 0.61)
  Top 0.254: U4.29 54.86,16.12 v59.56,20.83 60.2,20.83 63.63,24.26 ICSP.5
  Top 0.305: C5.2 28.83,29.46 27.18,27.81 RESET-EN.1
  Top 0.406: RESET-EN.2 RESET-EN.1 | TP_RESET.X 32.51,3.05 32.51,7.49 28.57,11.43 28.57,20.95 29.82,22.07 30.33,22.07 31.11,22.86 31.11,24.89 RESET-EN.2 | RN1.4 28.61,27.85 RESET-EN.2 | RESET.3 2.88,47.66 3.68,46.86 8,46.86 8.76,47.62 v8.89,47.66 RESET.4 | RESET-EN.2 30.23,28.83 v30.23,29.34 30.73,28.83 34.29,28.83 35.31,29.84 41.15,29.84 46.99,24 58.67,24 v59.44,24.77 D2.A
  Bottom 0.254: v8.89,47.66 9.89,48.67 10.05,48.64 12.7,48.64 15.11,46.23 16.38,46.23 17.02,46.86 17.02,48.01 17.8,48.79 21.87,48.79 23.93,46.74
  Bottom 0.305: 23.93,46.74 24.61,46.1 28.7,46.1 33.4,41.4 33.4,34.67 31.11,32.38 31.11,30.99 30.23,30.1 v30.23,29.34
  Bottom 0.406: v59.56,20.83 59.44,20.95 v59.44,24.77
RESET2  (via drill 0.61)
  Top 0.279: 16.85,37.12 U3.24
  Top 0.305: v22.61,46.61 22.61,47.62 21.46,48.77 17.02,48.77 TP_RESET2.X 13.51,47.5 D3.A 13.08,46.48 13,46.4 12.62,46.4 11.56,45.34 11.56,43.81 12.06,43.31 15.37,43.31 16.26,42.42 16.26,37.72 16.85,37.12
  Top 0.406: RN1.6 26.18,24.28 26.16,24.26 v25.84,24.53 v25.83,24.54
  Bottom 0.406: v22.61,46.61 22.86,46.35 22.86,44.58 23.88,43.56 23.88,42.29 24.38,41.78 25.53,41.78 26.14,41.17 26.14,40.18 24,38.05 24,30.23 26.16,28.07 26.16,24.87 v25.83,24.54
RXLED
  Top 0.279: RX.C 25.02,34.29 24.15,33.42 U3.10
SCK  (via drill 0.61)
  Top 0.254: U4.17 40.8,13.11 v39.78,12.14
  Top 0.305: v26.92,21.46 25.15,21.46 23.75,22.86 18.03,22.86 16.94,21.76 U5.5
  Bottom 0.406: ICSP.3 62.1,26.42 62.1,24.77 65.02,21.84 65.02,17.4 62.99,15.37 51.31,15.37 48.26,18.41 48.26,21.84 47.75,22.35 46.48,22.35 45.85,21.72 45.85,15.75 44.07,13.97 41.66,13.97 v39.78,12.14 38.73,12.14 37.72,13.21 37.72,14.22 36.58,15.37 30.73,15.37 27.81,18.29 27.81,20.07 26.92,20.95 v26.92,21.46 26.92,21.97 28.83,23.88 28.83,24.26 36.58,32 36.58,43.05 28.96,50.67 TP_13.X
SCK2
  Top 0.254: U3.15 23.48,35.92 24,36.45 24,43.56 21.34,46.23 20.32,46.23 19.05,47.5 TP_SCK2.X
SS  (via drill 0.61)
  Top 0.254: U4.14 37.33,15.12 32.77,19.68 v32.77,20.95
  Bottom 0.406: TP_10.X 36.58,50.42 39.5,47.5 39.5,29.72 32.77,22.99 v32.77,20.95
TP_VUCAP  (via drill 0.61)
  Top 0.279: U3.27 16.98,35.42 15.62,36.78 | 15.62,40.51 15.62,41.27 TP_VUCAP.X C8.1
  Top 0.305: 15.62,36.78 15.62,40.51
  other vias: 14.99,41.91
TXLED
  Top 0.279: U3.11 23.51,33.92 26.16,36.58 TX.C
UGND
  Top 0.279: U3.28 16.51,34.92 14.99,36.45
  Top 0.305: 14.99,36.45 14.99,39.88 14.22,40.64
  Top 0.406: C8.2 11.81,41.27 12.45,40.64 14.22,40.64
  Top 0.61: L1.1 8.72,45 C8.2
  Top 0.813: L1.1 8.74,44.51 4.45,40.16 4.45,37.47 5.08,36.83 6.5,36.83 X2.4
  Bottom 0.61: TP_UGND.X 6.5,36.83 X2.4
  Bottom 0.813: X2.4 5.06,36.85 4.45,37.47 4.45,40.01 5.71,41.27 10.03,41.27 GROUND.2
USBVCC  (via drill 0.61)
  Top 0.279: U3.31 16.78,33.42 16.64,33.27
  Top 0.406: 16.64,33.27 15.37,33.27 14.53,32.44 11.48,32.44 TP_USBVCC.X 9.91,28.96 10.54,28.32 10.54,27.18 9.88,26.52 T1.1
  Top 0.61: F1.1 3.47,24.51
  Top 0.813: 3.47,24.51 4.47,24.51 T1.1
  other vias: 9.91,30.86
USHIELD  (via drill 0.61)
  Top 0.61: TP_USH.X 9.02,42.67 11.7,39.99 Z1.2 | 11.06,33.54 11.19,33.54 11.3,33.66 Z2.2
  Top 0.813: L1.2 4.79,45.09 X2.P$1 | 11.06,33.54 5.25,33.54 X2.P$2
  Bottom 0.61: TP_USH.X 5.11,42.8 X2.P$1
  Bottom 0.813: X2.P$1 3.81,44.07 2.67,42.93 2.67,33.27 3.81,32.13 X2.P$2
  other vias: 9.02,42.8
VIN  (via drill 0.61)
  Top 0.305: RN1.8 24.82,22.68 24,23.5 17.53,23.5 15.24,21.21 15.24,19.3 14.8,18.86
  Top 0.61: 13.97,19.68 12.7,19.68 | 13.97,19.68 14.61,19.05 14.8,18.86 15.62,18.03 15.62,10.54 16.76,9.4 23.38,9.4 23.95,9.96 | 13.97,19.68 12.67,19.71 U1.3 | PC1.+ 25.54,11.43
  Top 0.813: v48.26,8.26 46.35,8.26 45.72,7.62 TP_VIN.X | D1.C 23.79,9.81 23.95,9.96 PC1.+ 25.53,10.79 27.81,8.51 v27.81,8
  Bottom 0.813: v48.26,8.26 47.75,8.26 46.35,6.86 37.59,6.86 36.7,7.75 28.07,7.75 v27.81,8
XT1
  Top 0.254: R1.1 18.29,29.72
  Top 0.279: 18.19,29.75 U3.1
  Top 0.305: R1.1 18.19,29.75
  Top 0.406: C9.1 16.89,26.67 16.51,26.67 TP_XT3.X
  Top 0.61: C9.1 R1.1
XT2
  Top 0.279: U3.2 18.69,30.84 R1.2
  Top 0.406: R1.2 C11.1 21.34,26.8 21.46,26.67 TP_XT4.X
XTAL1  (via drill 0.61)
  Top 0.254: R2.1 42.16,20.57 TP_XT1.X 41.66,20.19 41.3,19.83 U4.7
  Top 0.406: Y2.3 42.27,22.84 R2.1
  other vias: 42.55,20.19
XTAL2  (via drill 0.61)
  Top 0.254: R2.2 40.39,20.57 TP_XT2.X 40.51,20.19 40.8,19.91 U4.8
  Top 0.406: Y2.1 40.27,22.84 R2.2
  other vias: 40.01,20.19
XUSB
  Top 0.813: F1.2 2.5,28.49 1.4,29.59 1.4,33.78 2.54,34.92 7.62,34.92 8.51,35.81 X2.1
  Bottom 0.305: TP_XUSB.X X2.1

### Text on the board
Top: 3.325
Bottom: UNO SMD Rev3e
tPlace: 13 | 12 | 11 | 10 | 9 | 8 | 7 | 6 | 5 | 4 | 3 | 2 | 1 | 0 | MADE IN | ITALY
tNames: SCL | SDA | AREF | GND | # | # | # | # | # | # | DIGITAL | [#=PWM] | TX | RX | R | Arduino | TX | RX | UNO | Arduino.org | 1 | ANALOG IN | IOREF | RESET | 3V3 | 5V | GND | VIN | A0 | A1 | A2 | A3 | A4 | A5
bNames: designed by | MADE IN | tinker it | ITALY
ReferenceLC: L | TX | ON | RX | PC1 | PC2
214bmp: D:/SmartProjects/Snc/a4_bn_logo2.bmp